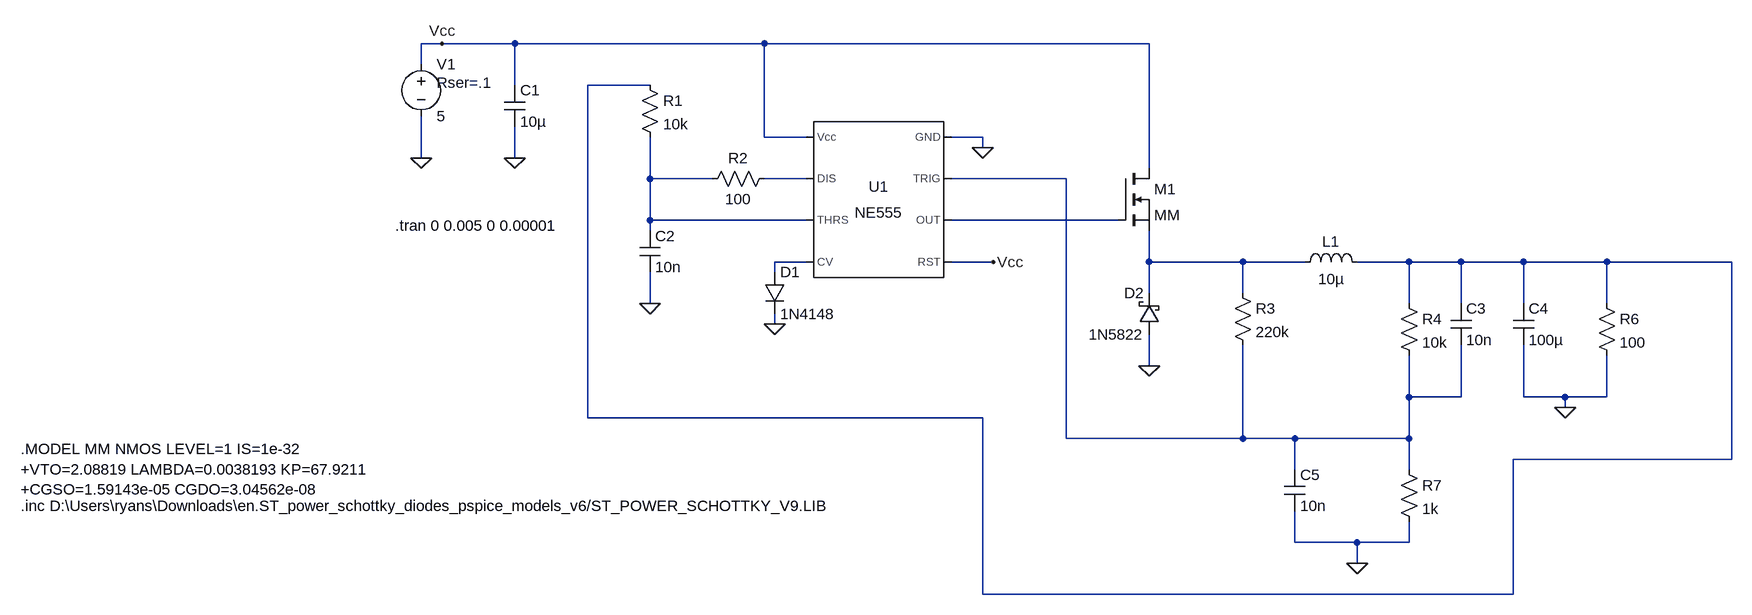
[diagram p0: schematic Converter.asc]
Converter.asc, the LTspice schematic file:
Version 4
SHEET 1 1540 680
WIRE -448 -560 -480 -560
WIRE -336 -560 -448 -560
WIRE 48 -560 -336 -560
WIRE 640 -560 48 -560
WIRE -480 -528 -480 -560
WIRE -336 -496 -336 -560
WIRE -128 -496 -224 -496
WIRE 48 -416 48 -560
WIRE 112 -416 48 -416
WIRE 384 -416 336 -416
WIRE 384 -400 384 -416
WIRE -480 -384 -480 -448
WIRE -336 -384 -336 -432
WIRE 640 -368 640 -560
WIRE -128 -352 -128 -416
WIRE -32 -352 -128 -352
WIRE 112 -352 48 -352
WIRE 512 -352 336 -352
WIRE -128 -288 -128 -352
WIRE 112 -288 -128 -288
WIRE 592 -288 336 -288
WIRE -128 -272 -128 -288
WIRE 112 -224 64 -224
WIRE 400 -224 336 -224
WIRE 640 -224 640 -272
WIRE 784 -224 640 -224
WIRE 880 -224 784 -224
WIRE 1040 -224 960 -224
WIRE 1120 -224 1040 -224
WIRE 1216 -224 1120 -224
WIRE 1344 -224 1216 -224
WIRE 1536 -224 1344 -224
WIRE 64 -208 64 -224
WIRE 640 -176 640 -224
WIRE 784 -176 784 -224
WIRE -128 -160 -128 -208
WIRE 1040 -160 1040 -224
WIRE 1120 -160 1120 -224
WIRE 1216 -160 1216 -224
WIRE 1344 -160 1344 -224
WIRE 64 -128 64 -144
WIRE 640 -64 640 -112
WIRE 1040 -16 1040 -80
WIRE 1120 -16 1120 -96
WIRE 1120 -16 1040 -16
WIRE 1216 -16 1216 -96
WIRE 1280 -16 1216 -16
WIRE 1344 -16 1344 -80
WIRE 1344 -16 1280 -16
WIRE 1280 0 1280 -16
WIRE -224 16 -224 -496
WIRE 384 16 -224 16
WIRE 512 48 512 -352
WIRE 784 48 784 -96
WIRE 784 48 512 48
WIRE 864 48 784 48
WIRE 1040 48 1040 -16
WIRE 1040 48 864 48
WIRE 1536 80 1536 -224
WIRE 1536 80 1200 80
WIRE 864 96 864 48
WIRE 1040 96 1040 48
WIRE 864 208 864 160
WIRE 960 208 864 208
WIRE 1040 208 1040 176
WIRE 1040 208 960 208
WIRE 960 240 960 208
WIRE 384 288 384 16
WIRE 1200 288 1200 80
WIRE 1200 288 384 288
FLAG -480 -384 0
FLAG 64 -128 0
FLAG -448 -560 Vcc
FLAG 384 -400 0
FLAG -128 -160 0
FLAG -336 -384 0
FLAG 400 -224 Vcc
FLAG 640 -64 0
FLAG 1280 0 0
FLAG 960 240 0
SYMBOL Misc\\NE555 224 -320 M0
SYMATTR InstName U1
SYMBOL voltage -480 -544 R0
WINDOW 123 0 0 Left 0
WINDOW 39 24 44 Left 2
SYMATTR SpiceLine Rser=.1
SYMATTR InstName V1
SYMATTR Value 5
SYMBOL cap -352 -496 R0
SYMATTR InstName C1
SYMATTR Value 10µ
SYMBOL res -144 -512 R0
SYMATTR InstName R1
SYMATTR Value 10k
SYMBOL res 64 -368 R90
WINDOW 0 0 56 VBottom 2
WINDOW 3 32 56 VTop 2
SYMATTR InstName R2
SYMATTR Value 100
SYMBOL cap -144 -272 R0
SYMATTR InstName C2
SYMATTR Value 10n
SYMBOL diode 48 -208 R0
SYMATTR InstName D1
SYMATTR Value 1N4148
SYMBOL nmos 592 -368 R0
SYMATTR InstName M1
SYMATTR Value MM
SYMBOL schottky 656 -112 R180
WINDOW 0 24 64 Left 2
WINDOW 3 24 0 Left 2
SYMATTR InstName D2
SYMATTR Value 1N5822
SYMBOL ind 864 -208 R270
WINDOW 0 32 56 VTop 2
WINDOW 3 5 56 VBottom 2
SYMATTR InstName L1
SYMATTR Value 10µ
SYMBOL res 768 -192 R0
SYMATTR InstName R3
SYMATTR Value 220k
SYMBOL res 1024 -176 R0
SYMATTR InstName R4
SYMATTR Value 10k
SYMBOL cap 1104 -160 R0
SYMATTR InstName C3
SYMATTR Value 10n
SYMBOL cap 1200 -160 R0
SYMATTR InstName C4
SYMATTR Value 100µ
SYMBOL res 1328 -176 R0
SYMATTR InstName R6
SYMATTR Value 100
SYMBOL cap 848 96 R0
SYMATTR InstName C5
SYMATTR Value 10n
SYMBOL res 1024 80 R0
SYMATTR InstName R7
SYMATTR Value 1k
TEXT -520 -280 Left 2 !.tran 0 0.005 0 0.00001
TEXT -1096 64 Left 2 !.MODEL MM NMOS LEVEL=1 IS=1e-32\n+VTO=2.08819 LAMBDA=0.0038193 KP=67.9211\n+CGSO=1.59143e-05 CGDO=3.04562e-08
TEXT -1096 152 Left 2 !.inc D:\\Users\\ryans\\Downloads\\en.ST_power_schottky_diodes_pspice_models_v6/ST_POWER_SCHOTTKY_V9.LIB

The netlist it stands for:
* Converter.asc
XU1 0 N004 N005 Vcc N006 N002 N003 Vcc NE555  ; pins GND TRIG OUT RST CV THRS DIS Vcc
V1 Vcc 0 5 Rser=.1
C1 Vcc 0 10µ
R1 N001 N002 10k
R2 N003 N002 100
C2 N002 0 10n
D1 N006 0 1N4148
M1 Vcc N005 N007 N007 MM
D2 0 N007 1N5822
L1 N007 N001 10µ
R3 N007 N004 220k
R4 N001 N004 10k
C3 N001 N004 10n
C4 N001 0 100µ
R6 N001 0 100
C5 N004 0 10n
R7 N004 0 1k
.model D D
.lib standard.dio
.model NMOS NMOS
.model PMOS PMOS
.lib standard.mos
.tran 0 0.005 0 0.00001
.MODEL MM NMOS LEVEL=1 IS=1e-32
+VTO=2.08819 LAMBDA=0.0038193 KP=67.9211
+CGSO=1.59143e-05 CGDO=3.04562e-08
.inc D:\Users\ryans\Downloads\en.ST_power_schottky_diodes_pspice_models_v6/ST_POWER_SCHOTTKY_V9.LIB
.lib NE555.sub
.backanno
.end